# EAGLE design darwin-sonar-module (EAGLE 9.5.0)
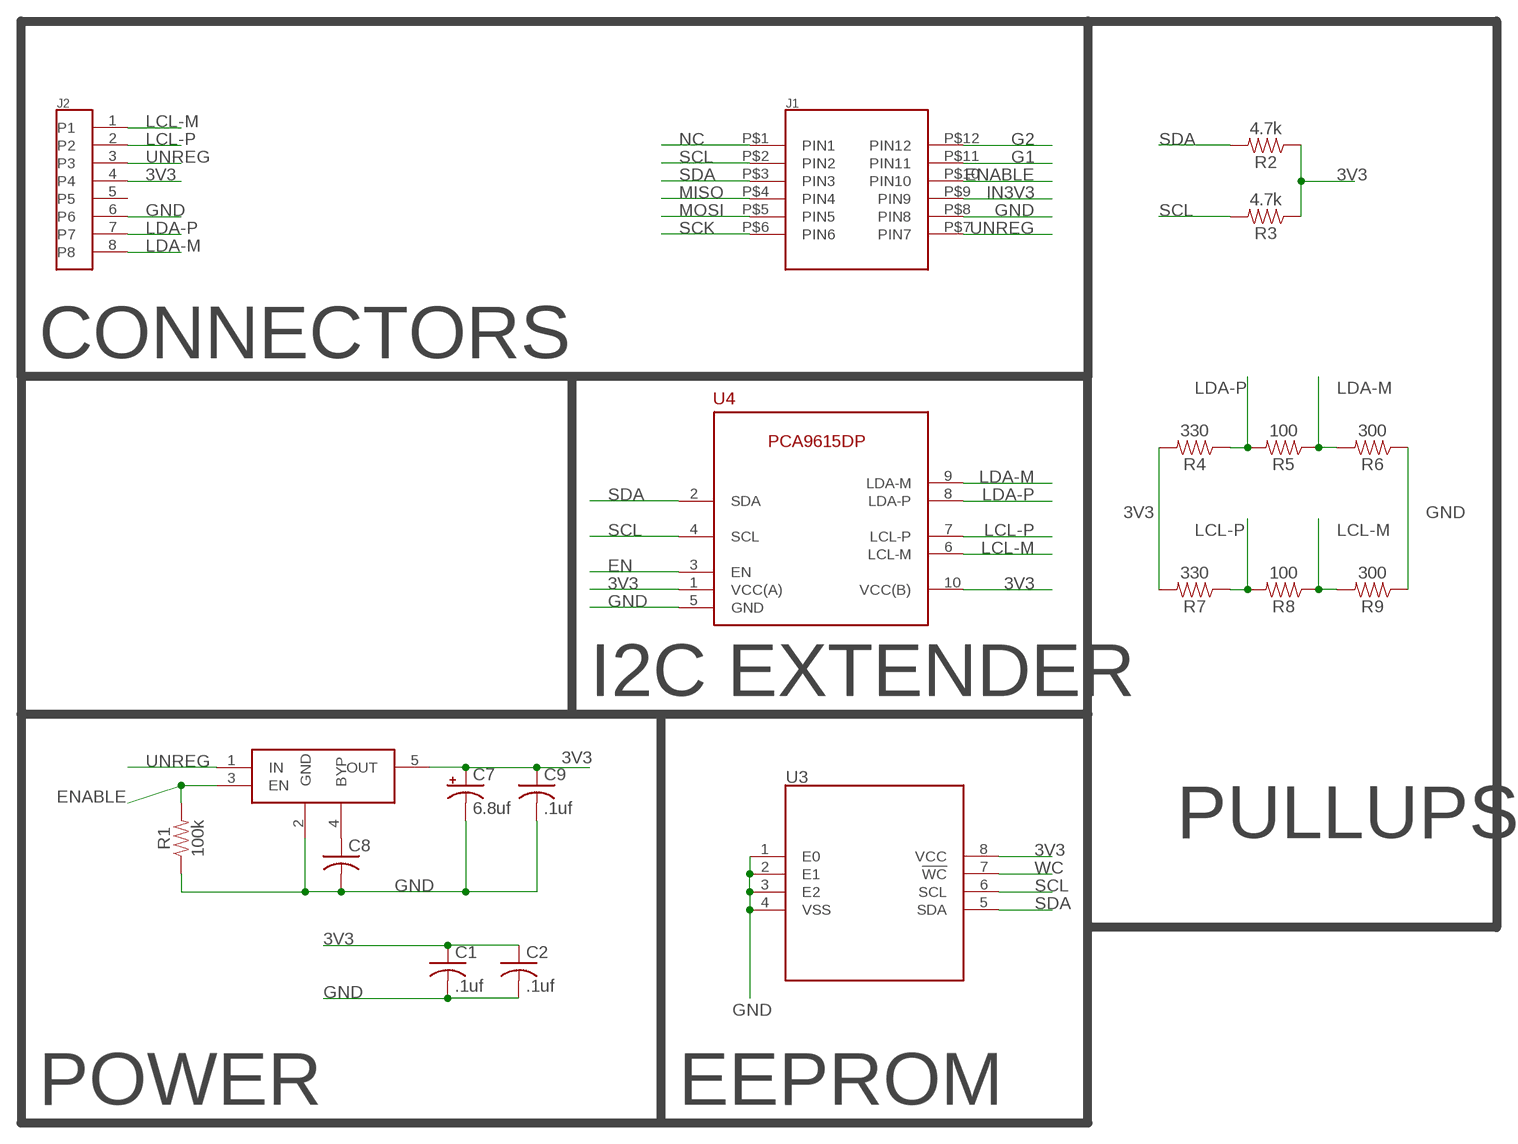
[diagram p0: schematic, sheet 1]

## Parts
C1  .1uf  C-USC0603K  [C0603K]
C2  .1uf  C-USC0603K  [C0603K]
C7  6.8uf  CPOL-USA/3216-18R  [A/3216-18R]
C8  C-USC0603K  [C0603K]
C9  .1uf  C-USC0603K  [C0603K]
J1  2X6-HEADERS  [M20-7810645]
J2  95501-6889VERT  [85513-5009]
R1  100k  100KOHM-0603-1/10W-1%  [0603]
R2  4.7k  100KOHM-0603-1/10W-1%  [0603]
R3  4.7k  100KOHM-0603-1/10W-1%  [0603]
R4  330  100KOHM-0603-1/10W-1%  [0603]
R5  100  100KOHM-0603-1/10W-1%  [0603]
R6  300  100KOHM-0603-1/10W-1%  [0603]
R7  330  100KOHM-0603-1/10W-1%  [0603]
R8  100  100KOHM-0603-1/10W-1%  [0603]
R9  300  100KOHM-0603-1/10W-1%  [0603]
U3  M24C02-WMN6TP  [SOIC127P600X175-8]
U4  PCA9615  [SOP50P490X110-10]
U$4  MIC5219-3.3YM5-TR  [SOT95P280X145-5]

## Nets
3V3: C1.1 C2.1 C7.+ C9.1 J2.4 R2.1 R3.1 R4.2 R7.2 U3.8(VCC) U4.1(VCC(A)) U4.10(VCC(B)) U$4.5(OUT)
EN: U4.3(EN)
ENABLE: J1.P$10(PIN10) R1.2 U$4.3(EN)
G1: J1.P$11(PIN11)
G2: J1.P$12(PIN12)
GND: C1.2 C2.2 C7.- C8.2 C9.2 J1.P$8(PIN8) J2.6 R1.1 R6.1 R9.1 U3.1(E0) U3.2(E1) U3.3(E2) U3.4(VSS) U4.5(GND) U$4.2(GND)
IN3V3: J1.P$9(PIN9)
LCL-M: J2.1 R8.1 R9.2 U4.6(LCL-M)
LCL-P: J2.2 R7.1 R8.2 U4.7(LCL-P)
LDA-M: J2.8 R5.1 R6.2 U4.9(LDA-M)
LDA-P: J2.7 R4.1 R5.2 U4.8(LDA-P)
MISO: J1.P$4(PIN4)
MOSI: J1.P$5(PIN5)
N$6: C8.1 U$4.4(BYP)
NC: J1.P$1(PIN1)
SCK: J1.P$6(PIN6)
SCL: J1.P$2(PIN2) R3.2 U3.6(SCL) U4.4(SCL)
SDA: J1.P$3(PIN3) R2.2 U3.5(SDA) U4.2(SDA)
UNREG: J1.P$7(PIN7) J2.3 U$4.1(IN)
WC: U3.7(!WC)
Unconnected: J2.5

## Notes on the sheet
- CONNECTORS
- I2C EXTENDER
- PULLUPS
- POWER | EEPROM

## Library data of the parts
C1 C2 C8 C9 = rcl:C-US: CAPACITOR, American symbol; SPICEPREFIX: C
C7 = rcl:CPOL-US: POLARIZED CAPACITOR, American symbol; SPICEPREFIX: C
J1 = Conservify:2X6-HEADERS
J2 = Conservify:95501-6889: Molex RJ-45 Connector
R1 = SparkFun-Resistors:100KOHM: 100kΩ resistor A resistor is a passive two-terminal electrical component that implements electrical resistance as a circuit element. Resistors act to reduce current flow, and, at the same time, act to lower voltage levels within circuits. - Wikipedia; PROD_ID: RES-07828
R2-R9 = SparkFun-Resistors:100KOHM: 100kΩ resistor A resistor is a passive two-terminal electrical component that implements electrical resistance as a circuit element. Resistors act to reduce current flow, and, at the same time, act to lower voltage levels within circuits. - Wikipedia; PROD_ID: RES-07828; VALUE: 100k
U3 = Conservify:M24C02-WMN6TP
U4 = Conservify:PCA9615
U$4 = Conservify:MIC5219-3.3YM5-TR

## Board
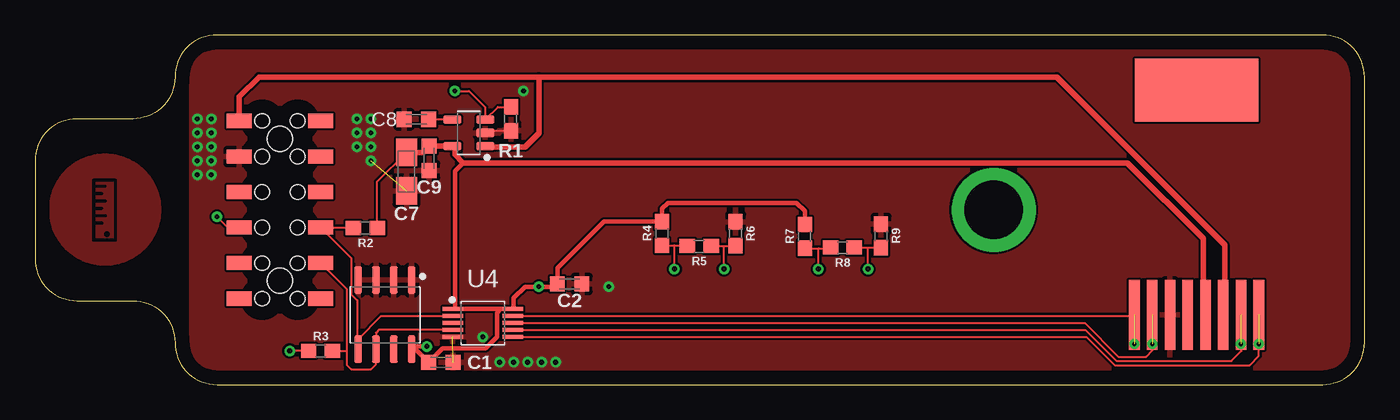
[diagram p1: board, top side]
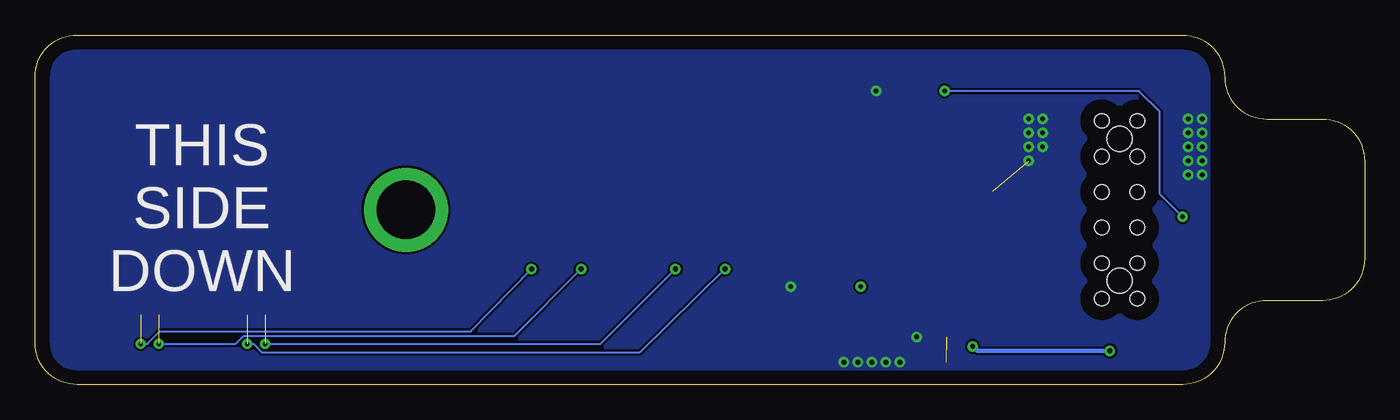
[diagram p2: board, bottom side, seen from below]

Size 95 x 25 mm. Coordinates in mm from the lower left corner, seen from the top.
Outline: 92,0 arc90 95,3 95,22 arc90 92,25 13,25 arc90 10,22 arc-90 7,19 3,19 arc90 0,16 0,9 arc90 3,6 7,6 arc-90 10,3 arc90 13,0 92,0
Copper layers (1*16): Top 0.035mm / dielectric 1.5mm / Bottom 0.035mm
Design rules "default": minimum track width 6mil, minimum drill 0.35mm, track to track 6mil, track to pad 6mil, pad to pad 6mil, via to via 6mil, smd to smd 6mil, copper to edge 40mil, drill to drill 6mil, minimum pad ring 10mil, minimum via ring 8mil, stop-mask expansion 4mil, vias tented up to drill 0mil, thermal gap 10mil

### Footprints (pad centres in the part's own frame; a part is rotated, then mirrored left to right if it is on the bottom)
C0603K = smd 1.05 x 1.08: 1 -0.875,0; 2 0.875,0
A/3216-18R = smd 1.95 x 1.5: + 1.375,0; - -1.375,0
M20-7810645 = smd 1.02 x 1.78: P$1 -6.35,-2.91; P$2 -3.81,-2.91; P$3 -1.27,-2.91; P$4 1.27,-2.91; P$5 3.81,-2.91; P$6 6.35,-2.91; P$7 6.35,2.91; P$8 3.81,2.91; P$9 1.27,2.91; P$10 -1.27,2.91; P$11 -3.81,2.91; P$12 -6.35,2.91 | hole 1.02: -6.35,1.27; -3.81,1.27; -1.27,1.27; 1.27,1.27; 3.81,1.27; 6.35,1.27; 6.35,-1.27; 3.81,-1.27; 1.27,-1.27; -1.27,-1.27; -3.81,-1.27; -6.35,-1.27 | hole 1.8: -5.08,0; 5.08,0
85513-5009 = smd 0.76 x 5: 1 4.445,0; 2 3.175,0; 3 1.905,0; 4 0.635,0; 5 -0.635,0; 6 -1.905,0; 7 -3.175,0; 8 -4.445,0 | smd 8.8 x 4.5: P$1 0,16.05
0603 = smd 1.1 x 1: 1 -0.85,0; 2 0.85,0
SOIC127P600X175-8 = smd 1.968 x 0.569: 1 -2.473,1.905; 2 -2.473,0.635; 3 -2.473,-0.635; 4 -2.473,-1.905; 5 2.473,-1.905; 6 2.473,-0.635; 7 2.473,0.635; 8 2.473,1.905
SOP50P490X110-10 = smd 1.438 x 0.297: 1 -2.145,1; 2 -2.145,0.5; 3 -2.145,0; 4 -2.145,-0.5; 5 -2.145,-1; 6 2.145,-1; 7 2.145,-0.5; 8 2.145,0; 9 2.145,0.5; 10 2.145,1
SOT95P280X145-5 = smd 1.262 x 0.609: 1 -1.175,0.95; 2 -1.175,0; 3 -1.175,-0.95; 4 1.175,-0.95; 5 1.175,0.95

### Placement (x,y rotation side)
C1  29,1.6 0 top
C2  38.2,7.2 0 top
C7  26.54,15.23 90 top
C8  27.25,18.97 180 top
C9  28.17,16.18 270 top
J1  17.5,12.5 90 top
J2  83,5 0 top
R1  34,19 90 top
R2  23.6,11.2 180 top
R3  20.4,2.4 0 top
R4  44.8,10.8 90 top
R5  47.46,9.89 180 top
R6  50.06,10.79 270 top
R7  55,10.6 90 top
R8  57.69,9.79 180 top
R9  60.45,10.62 270 top
U3  25,5 270 top
U4  32,4.4 0 top
U$4  31,18 180 top

### Tracks (layer width: path | path; a pad name or v marks a point on that pad's centre or on a via)
3V3  (via drill 0.35)
  Top 0.152: C9.1 27.73,16.61 | C2.1 37.12,7 | 27,2.73 27.2,2.53 U3.8 | R2.1 24.45,14.52 C7.+ | R3.1 v18.2,2.4 | 33.27,5.4 U4.10 34.2,5.46 | 30,5.4 U4.1 | U$4.5 30,16.88
  Top 0.305: 27,2.73 v28,2.73 | 37.12,7 v36,7 35,7 34.2,6.2 34.2,5.46 | 27.2,2.53 C1.1 29.12,2.6 32.2,2.6 33,3.4 33,5.13 33.27,5.4 | R7.2 55,12.4 54.4,13 45.23,13 44.8,12.57 R4.2 40.65,11.65 37.33,8.32 C2.1 | U4.10 30,5.4 30,15.26 30.59,15.86
  Top 0.406: U$4.5 C9.1 | 27.73,16.61 C7.+ | 30,16.88 30,16.45 30.59,15.86 78.07,15.86 83.48,10.44 83.48,6.55 83.64,6.4 J2.4
  Bottom 0.305: v18.2,2.4 27.67,2.4 v28,2.73
ENABLE  (via drill 0.35)
  Top 0.152: R1.2 33.08,19.85 U$4.3 32.17,19.82 31,21 v30,21 | J1.P$10 13.77,11.23 v13,12
  Bottom 0.152: v13,12 14.63,13.63 14.63,19.51 16.11,21 v30,21
GND  (via drill 0.35)  (2 unrouted)
  Top 0.152: U$4.2 32.33,18.15 R1.1
  other vias: 23,19 24,19 24,18 23,18 24,17 23,17 24,16 11.6,19 11.6,18 11.6,17 11.6,16 11.6,15 12.6,19 12.6,18 12.6,17 12.6,16 12.6,15 32,3.4 34.9,21 37.2,1.6 33.2,1.6 34.2,1.6 35.2,1.6 36.2,1.6 41,7
  pour Top: 11.2,24 94,24 94,1 11.2,1
  pour Bottom: 11.2,24 94,24 94,1 11.2,1
GND1
  pour Top (rank 3): 5.37,10.76 5.37,10.72 5.36,10.69 5.35,10.65 5.33,10.62 5.31,10.59 5.29,10.58 5.27,10.56 5.24,10.55 5.22,10.54 5.2,10.53 5.18,10.53 5.14,10.52 5.14,10.47 5.49,10.47 5.49,10.76
  pour Top (rank 3): 5.13,10.52 5.1,10.53 5.08,10.53 5.04,10.55 5.01,10.56 4.99,10.58 4.97,10.59 4.95,10.63 4.92,10.67 4.91,10.7 4.91,10.72 4.91,10.76 4.9,10.76 4.33,10.76 4.33,10.76 4.33,10.47 4.33,10.47 5.14,10.47 5.14,10.52
  pour Top (rank 3): 4.91,10.77 4.91,10.82 4.92,10.84 4.93,10.86 4.94,10.88 4.95,10.9 4.97,10.91 4.98,10.93 5,10.95 5.02,10.96 5.04,10.97 5.07,10.98 5.11,10.99 5.13,10.99 5.15,10.99 5.2,10.98 5.23,10.97 5.25,10.96 5.27,10.95 5.31,10.92 5.33,10.9 5.34,10.88 5.36,10.85 5.36,10.83 5.37,10.81 5.38,10.76 5.49,10.76 5.49,14.47 5.49,14.47 4.33,14.47 4.33,14.32 5.02,14.32 5.04,14.32 5.06,14.31 5.08,14.3 5.1,14.28 5.11,14.27 5.13,14.24 5.14,14.22 5.14,14.2 5.14,14.17 5.14,14.15 5.13,14.12 5.12,14.1 5.1,14.08 5.08,14.06 5.05,14.05 5.03,14.04 5.01,14.04 4.32,14.04 4.32,14.04 4.32,13.79 4.76,13.79 4.79,13.79 4.82,13.78 4.83,13.77 4.85,13.76 4.87,13.74 4.88,13.72 4.89,13.7 4.9,13.67 4.9,13.65 4.9,13.63 4.89,13.61 4.88,13.58 4.87,13.56 4.86,13.55 4.83,13.53 4.81,13.52 4.79,13.51 4.76,13.51 4.33,13.51 4.33,13.26 5.02,13.26 5.03,13.26 5.06,13.26 5.08,13.25 5.1,13.24 5.11,13.22 5.12,13.21 5.14,13.19 5.15,13.17 5.15,13.15 5.15,13.12 5.15,13.09 5.15,13.07 5.13,13.04 5.11,13.02 5.09,13.01 5.06,12.99 5.04,12.98 5.02,12.98 4.33,12.98 4.33,12.98 4.33,12.74 4.76,12.74 4.79,12.74 4.81,12.73 4.83,12.72 4.85,12.71 4.87,12.69 4.88,12.67 4.89,12.65 4.9,12.63 4.9,12.61 4.9,12.58 4.89,12.56 4.88,12.53 4.87,12.52 4.86,12.5 4.83,12.48 4.81,12.47 4.79,12.47 4.76,12.46 4.33,12.46 4.33,12.21 5.02,12.21 5.03,12.21 5.05,12.21 5.07,12.2 5.09,12.19 5.11,12.18 5.12,12.16 5.13,12.15 5.14,12.12 5.15,12.11 5.15,12.09 5.15,12.07 5.15,12.04 5.15,12.02 5.13,11.99 5.11,11.97 5.09,11.96 5.06,11.94 5.04,11.93 5.02,11.93 4.33,11.93 4.33,11.93 4.33,11.68 4.75,11.68 4.78,11.68 4.8,11.68 4.83,11.67 4.85,11.66 4.87,11.65 4.88,11.63 4.9,11.61 4.91,11.59 4.91,11.56 4.91,11.55 4.91,11.52 4.91,11.5 4.9,11.47 4.89,11.46 4.87,11.44 4.85,11.42 4.83,11.41 4.81,11.41 4.78,11.4 4.33,11.4 4.33,10.76 4.91,10.76
  pour Top (rank 3): 5.49,14.47 5.49,10.76 5.61,10.76 5.61,14.47
  pour Top (rank 3): 4.18,10.18 4.16,10.19 4.13,10.19 4.11,10.2 4.09,10.22 4.07,10.25 4.05,10.27 4.05,10.3 4.04,10.32 4.05,14.62 4.05,14.64 4.05,14.66 4.06,14.68 4.08,14.7 4.09,14.71 4.11,14.73 4.13,14.74 4.15,14.75 4.18,14.75 5.49,14.75 5.49,14.75 5.49,16.48 5.42,16.49 5.21,16.51 5.01,16.51 4.8,16.51 4.6,16.49 4.4,16.47 4.2,16.43 4,16.39 3.81,16.33 3.63,16.27 3.45,16.2 3.27,16.12 3.1,16.03 2.93,15.93 2.77,15.83 2.61,15.72 2.46,15.6 2.31,15.47 2.17,15.34 2.04,15.2 1.92,15.06 1.8,14.9 1.68,14.75 1.58,14.58 1.48,14.42 1.39,14.24 1.31,14.07 1.24,13.88 1.18,13.7 1.13,13.51 1.08,13.31 1.05,13.12 1.02,12.92 1.01,12.71 1,12.51 1.01,12.3 1.02,12.1 1.05,11.9 1.08,11.7 1.13,11.5 1.18,11.32 1.24,11.13 1.31,10.95 1.39,10.77 1.48,10.6 1.58,10.43 1.68,10.27 1.8,10.11 1.91,9.96 2.04,9.81 2.17,9.67 2.31,9.54 2.46,9.41 2.61,9.3 2.77,9.18 2.93,9.08 3.1,8.98 3.27,8.9 3.45,8.82 3.63,8.74 3.82,8.68 4,8.63 4.2,8.58 4.4,8.55 4.6,8.52 4.8,8.51 5.01,8.5 5.21,8.51 5.42,8.52 5.49,8.53 5.49,10.18
  pour Top (rank 3): 9.01,12.71 8.99,12.92 8.97,13.12 8.93,13.32 8.89,13.51 8.83,13.7 8.77,13.88 8.7,14.07 8.62,14.24 8.53,14.42 8.43,14.59 8.33,14.75 8.22,14.9 8.1,15.05 7.97,15.2 7.84,15.34 7.7,15.47 7.55,15.6 7.4,15.72 7.25,15.83 7.08,15.93 6.92,16.03 6.74,16.12 6.57,16.2 6.38,16.27 6.2,16.33 6.01,16.39 5.81,16.43 5.62,16.47 5.49,16.48 5.49,14.75 5.76,14.75 5.78,14.75 5.8,14.74 5.82,14.73 5.83,14.72 5.85,14.71 5.86,14.69 5.87,14.68 5.88,14.66 5.89,14.64 5.89,14.62 5.89,10.31 5.89,10.29 5.88,10.27 5.87,10.25 5.86,10.23 5.85,10.22 5.83,10.21 5.81,10.2 5.79,10.19 5.77,10.18 5.76,10.18 5.49,10.18 5.49,10.18 5.49,8.53 5.62,8.55 5.81,8.58 6.01,8.63 6.2,8.68 6.38,8.74 6.57,8.81 6.74,8.9 6.92,8.98 7.08,9.08 7.25,9.18 7.4,9.3 7.56,9.42 7.7,9.54 7.84,9.67 7.97,9.81 8.1,9.96 8.22,10.11 8.33,10.27 8.43,10.43 8.53,10.6 8.62,10.77 8.7,10.95 8.77,11.13 8.83,11.31 8.89,11.5 8.93,11.7 8.97,11.9 8.99,12.1 9.01,12.3 9.01,12.51
  pour Top (rank 3): 5.49,10.76 5.49,10.47 5.61,10.47 5.61,10.76
LCL-M  (via drill 0.3, 0.35)  (1 unrouted)
  Top 0.152: U4.6 75.14,3.4 77.15,1.39 86.79,1.39 87.44,2.04 J2.1 | R8.1 59.53,9.79 | 59.53,9.79 60.43,9.79 R9.2 | v59.53,8.26 59.53,9.79
  Bottom 0.152: v59.53,8.26 63.87,3.79 86.09,3.79 86.97,2.9 v87.45,2.9
LCL-P  (via drill 0.3, 0.35)  (1 unrouted)
  Top 0.152: U4.7 75.07,3.9 77.27,1.7 85.5,1.7 86.2,2.4 86.2,4.97 J2.2 | R7.1 56,9.75 | 56,9.75 56.8,9.75 R8.2 | v55.97,8.26 55.97,9.72 56,9.75
  Bottom 0.152: v86.15,2.9 80.67,2.9 80.09,3.48 60.75,3.48 v55.97,8.26
LDA-M  (via drill 0.3, 0.35)  (1 unrouted)
  Top 0.152: J2.8 78.58,4.97 78.5,4.9 U4.9 | R5.1 49.24,9.89 | 49.24,9.89 50.02,9.89 R6.2 | v49.24,8.26 49.24,9.89
  Bottom 0.152: v78.55,2.9 54.6,2.9 v49.24,8.26
LDA-P  (via drill 0.3, 0.35)  (1 unrouted)
  Top 0.152: J2.7 79.85,4.97 79.85,2.45 79.4,2 77.4,2 75,4.4 U4.8 | R4.1 45.69,9.95 | 45.69,9.95 46.55,9.95 R5.2 | v45.69,8.26 45.69,9.95
  Bottom 0.152: v79.85,2.9 79.37,2.9 78.79,2.32 51.75,2.32 v45.69,8.26
N$1  (via drill 4.2 pad 6)
  other vias: 68.5,12.5
N$6
  Top 0.152: C8.1 29.81,18.97 U$4.4
SCL
  Top 0.152: J1.P$2 22.28,6.82 22.28,2.42 | 22.28,2.42 22.28,1.42 22.6,1.1 22.6,1.09 24,1.09 24.37,1.46 U3.6 24.37,3.7 24.61,3.94 29.82,3.94 U4.4 | R3.2 22.26,2.4 22.28,2.42
SDA
  Top 0.152: R2.2 22.72,11.23 J1.P$3 22.58,9.06 22.58,6.46 23.02,6.02 23.02,2.6 U3.5 23.09,3.25 24.75,4.9 24.81,4.9 25,4.9 U4.2
UNREG
  Top 0.406: J1.P$7 14.59,20.59 16,22 35.98,22 | U$4.1 32.23,17 35,17 36,18 36,21.98 35.98,22 | J2.3 85,5.09 85,10 73,22 35.98,22

### Text on the board
bPlace: THIS / SIDE / DOWN